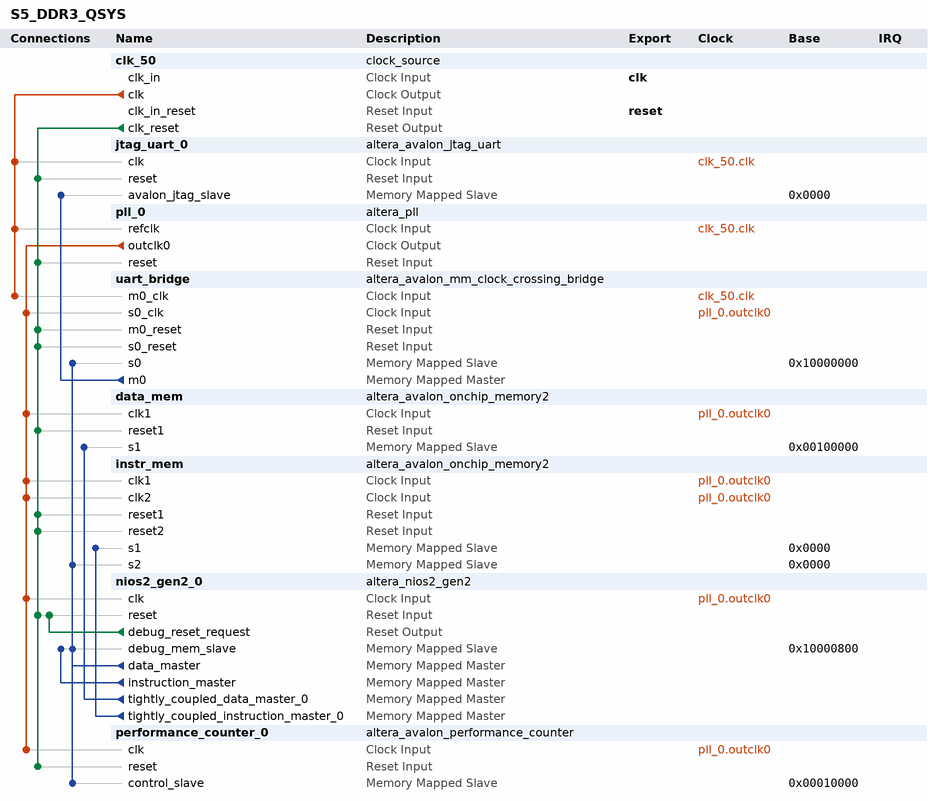
[diagram p0: system contents]
# Platform Designer (Qsys) system S5_DDR3_QSYS, Stratix V 5SGXEA7N2F45C2
# Parameters at their usual value, and those the tool derives, are not listed.
package require -exact qsys 16.1
create_system S5_DDR3_QSYS
set_project_property DEVICE_FAMILY {Stratix V}
set_project_property DEVICE 5SGXEA7N2F45C2

add_instance clk_50 clock_source 16.1
set_instance_parameter_value clk_50 clockFrequency 50000000

add_instance jtag_uart_0 altera_avalon_jtag_uart 16.1
set_instance_parameter_value jtag_uart_0 simInteractiveOptions NO_INTERACTIVE_WINDOWS

add_instance pll_0 altera_pll 16.1
set_instance_parameter_value pll_0 gui_device_speed_grade 1
set_instance_parameter_value pll_0 gui_number_of_clocks 1
set_instance_parameter_value pll_0 gui_operation_mode direct
set_instance_parameter_value pll_0 gui_output_clock_frequency0 250.0
set_instance_parameter_value pll_0 gui_pll_mode {Integer-N PLL}
set_instance_parameter_value pll_0 gui_reference_clock_frequency 50.0
set_instance_parameter_value pll_0 gui_use_locked true

add_instance uart_bridge altera_avalon_mm_clock_crossing_bridge 16.1
set_instance_parameter_value uart_bridge ADDRESS_WIDTH 3
set_instance_parameter_value uart_bridge COMMAND_FIFO_DEPTH 4
set_instance_parameter_value uart_bridge DATA_WIDTH 32
set_instance_parameter_value uart_bridge MASTER_SYNC_DEPTH 2
set_instance_parameter_value uart_bridge MAX_BURST_SIZE 1
set_instance_parameter_value uart_bridge RESPONSE_FIFO_DEPTH 4
set_instance_parameter_value uart_bridge SLAVE_SYNC_DEPTH 2
set_instance_parameter_value uart_bridge USE_AUTO_ADDRESS_WIDTH 0

add_instance data_mem altera_avalon_onchip_memory2 16.1
set_instance_parameter_value data_mem dataWidth 32
set_instance_parameter_value data_mem dualPort false
set_instance_parameter_value data_mem initMemContent true
set_instance_parameter_value data_mem initializationFileName onchip_mem.hex
set_instance_parameter_value data_mem memorySize 65536

add_instance instr_mem altera_avalon_onchip_memory2 16.1
set_instance_parameter_value instr_mem dataWidth 32
set_instance_parameter_value instr_mem dualPort true
set_instance_parameter_value instr_mem initMemContent false
set_instance_parameter_value instr_mem initializationFileName onchip_mem.hex
set_instance_parameter_value instr_mem memorySize 16384

add_instance nios2_gen2_0 altera_nios2_gen2 16.1
set_instance_parameter_value nios2_gen2_0 dcache_numTCDM 1
set_instance_parameter_value nios2_gen2_0 dcache_size 0
set_instance_parameter_value nios2_gen2_0 exceptionSlave instr_mem.s1
set_instance_parameter_value nios2_gen2_0 icache_numTCIM 1
set_instance_parameter_value nios2_gen2_0 icache_size 0
set_instance_parameter_value nios2_gen2_0 impl Fast
set_instance_parameter_value nios2_gen2_0 resetSlave instr_mem.s1

add_instance performance_counter_0 altera_avalon_performance_counter 16.1
set_instance_parameter_value performance_counter_0 numberOfSections 3

# connections
add_connection clk_50.clk jtag_uart_0.clk clock
add_connection clk_50.clk pll_0.refclk clock
add_connection clk_50.clk uart_bridge.m0_clk clock
add_connection pll_0.outclk0 data_mem.clk1 clock
add_connection pll_0.outclk0 instr_mem.clk1 clock
add_connection pll_0.outclk0 instr_mem.clk2 clock
add_connection pll_0.outclk0 nios2_gen2_0.clk clock
add_connection pll_0.outclk0 performance_counter_0.clk clock
add_connection pll_0.outclk0 uart_bridge.s0_clk clock
add_connection clk_50.clk_reset data_mem.reset1 reset
add_connection clk_50.clk_reset instr_mem.reset1 reset
add_connection clk_50.clk_reset instr_mem.reset2 reset
add_connection clk_50.clk_reset jtag_uart_0.reset reset
add_connection clk_50.clk_reset nios2_gen2_0.reset reset
add_connection clk_50.clk_reset performance_counter_0.reset reset
add_connection clk_50.clk_reset pll_0.reset reset
add_connection clk_50.clk_reset uart_bridge.m0_reset reset
add_connection clk_50.clk_reset uart_bridge.s0_reset reset
add_connection nios2_gen2_0.debug_reset_request nios2_gen2_0.reset reset
add_connection nios2_gen2_0.data_master instr_mem.s2 avalon
set_connection_parameter_value nios2_gen2_0.data_master/instr_mem.s2 baseAddress 0x0000
add_connection nios2_gen2_0.data_master nios2_gen2_0.debug_mem_slave avalon
set_connection_parameter_value nios2_gen2_0.data_master/nios2_gen2_0.debug_mem_slave baseAddress 0x10000800
add_connection nios2_gen2_0.data_master performance_counter_0.control_slave avalon
set_connection_parameter_value nios2_gen2_0.data_master/performance_counter_0.control_slave baseAddress 0x00010000
add_connection nios2_gen2_0.data_master uart_bridge.s0 avalon
set_connection_parameter_value nios2_gen2_0.data_master/uart_bridge.s0 baseAddress 0x10000000
add_connection nios2_gen2_0.instruction_master nios2_gen2_0.debug_mem_slave avalon
set_connection_parameter_value nios2_gen2_0.instruction_master/nios2_gen2_0.debug_mem_slave baseAddress 0x10000800
add_connection nios2_gen2_0.tightly_coupled_data_master_0 data_mem.s1 avalon
set_connection_parameter_value nios2_gen2_0.tightly_coupled_data_master_0/data_mem.s1 baseAddress 0x00100000
add_connection nios2_gen2_0.tightly_coupled_instruction_master_0 instr_mem.s1 avalon
set_connection_parameter_value nios2_gen2_0.tightly_coupled_instruction_master_0/instr_mem.s1 baseAddress 0x0000
add_connection uart_bridge.m0 jtag_uart_0.avalon_jtag_slave avalon
set_connection_parameter_value uart_bridge.m0/jtag_uart_0.avalon_jtag_slave baseAddress 0x0000

# exported interfaces
add_interface clk clock sink
set_interface_property clk EXPORT_OF clk_50.clk_in
add_interface reset reset sink
set_interface_property reset EXPORT_OF clk_50.clk_in_reset

set_interconnect_requirement {$system} qsys_mm.clockCrossingAdapter FIFO
set_interconnect_requirement {$system} qsys_mm.maxAdditionalLatency 4

save_system S5_DDR3_QSYS.qsys
